# Altium schematic sheet SSFocuser-B-TMC2208-O.SchDoc: YNAO Focuser
size A4; DrawnBy: ShouSheng He; Revision: v1.0
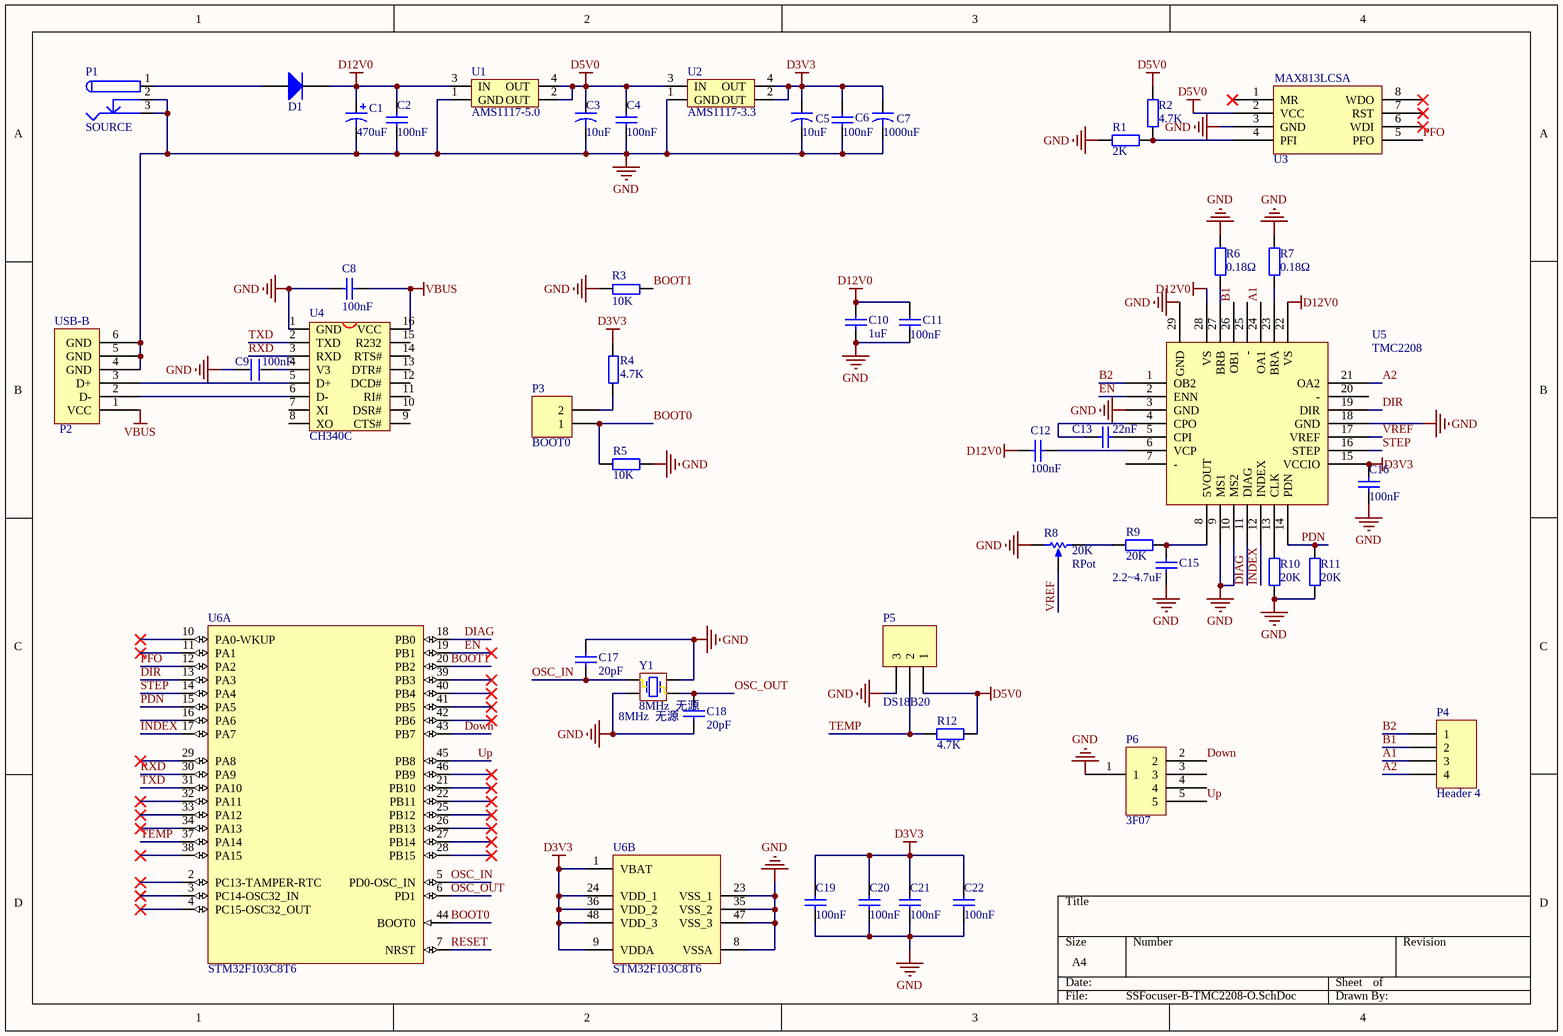
[diagram p0: SSFocuser-B-TMC2208-O.SchDoc]

## Parts
C1  470uF  [16V/470U(CD10X10D5)]
C2  100nF  [0603C]
C3  10uF  [3216]
C4  100nF  [0603C]
C5  10uF  [3216]
C6  100nF  [0603C]
C7  1000uF  [16V/470U(CD10X10D5)]
C8  100nF  [0603C]
C9  100nF  [0603C]
C10  1uF  [1206C]
C11  100nF  [0603C]
C12  100nF  [0603C]
C13  22nF  [0603C]
C15  2.2~4.7uF  [0603C]
C16  100nF  [0603C]
C17  20pF  [0603C]
C18  20pF  [0603C]
C19  100nF  [0603C]
C20  100nF  [0603C]
C21  100nF  [0603C]
C22  100nF  [0603C]
D1  M7  [DO-214AC]  (value not drawn)
P1  SOURCE  [DC005]
P2  USB-B  [USB-B]
P3  BOOT0  [HDR1X2]
P4  Header 4  [XH_4_V]
P5  DS18B20  [TO-92B]
P6  3F07  [3F07]
R1  2K  [0603R]
R2  4.7K  [0603R]
R3  10K  [0603R]
R4  4.7K  [0603R]
R5  10K  [0603R]
R6  0.18Ω  [1206R]
R7  0.18Ω  [1206R]
R8  RPot  value 20K  [VR_SMD]
R9  20K  [0603R]
R10  20K  [0603R]
R11  20K  [0603R]
R12  4.7K  [0603R]
U1  AMS1117-5.0  [SOT223]
U2  AMS1117-3.3  [SOT223]
U3  MAX813LCSA  [SOP-8]
U4  CH340C  [SO-16]
U5  TMC2208  [QFN28]
U6  STM32F103C8T6  [LQFP48_N]  (parts A,B of 2)
Y1  8MHz  无源  [X3225]

## Nets
D3V3: C5.1 C6.2 C7.1 C16.2 C19.2 C20.2 C21.2 C22.2 R4.2 U2.2(OUT) U2.4(OUT) U5.15(VCCIO) U6.1(VBAT) U6.9(VDDA) U6.24(VDD_1) U6.36(VDD_2) U6.48(VDD_3)
D5V0: C3.1 C4.2 P5.1 R2.2 R12.2 U1.2(OUT) U1.4(OUT) U2.3(IN) U3.2(VCC)
D12V0: C1.1 C2.2 C10.1 C11.2 C12.2 D1.2(K) U1.3(IN) U5.22(VS) U5.28(VS)
GND: C1.2 C2.1 C3.2 C4.1 C5.2 C6.1 C7.2 C8.1 C9.1 C10.2 C11.1 C15.1 C16.1 C17.2 C18.2 C19.1 C20.1 C21.1 C22.1 P1.2 P1.3 P2.4(GND) P2.5(GND) P2.6(GND) P5.3 P6.1 R1.2 R3.1 R5.2 R6.1 R7.1 R8.1(TOP) R10.1 R11.1 U1.1(GND) U2.1(GND) U3.3(GND) U4.1(GND) U5.3(GND) U5.9(MS1) U5.10(MS2) U5.18(GND) U5.29(GND) U6.8(VSSA) U6.23(VSS_1) U6.35(VSS_2) U6.47(VSS_3) Y1.2(NA) Y1.4(NA)
VBUS: C8.2 P2.1(VCC) U4.16(VCC)
A1: P4.3 U5.24(OA1)
A2: P4.4 U5.21(OA2)
B1: P4.2 U5.26(OB1)
B2: P4.1 U5.1(OB2)
BOOT0: P3.1 R5.1 U6.44(BOOT0)
BOOT1: R3.2 U6.20(PB2)
DIAG: U5.11(DIAG) U6.18(PB0)
DIR: U5.19(DIR) U6.13(PA3)
Down: P6.2 U6.43(PB7)
EN: U5.2(ENN) U6.19(PB1)
INDEX: U5.12(INDEX) U6.17(PA7)
OSC_IN: C17.1 U6.5(PD0-OSC_IN) Y1.1(OSC1)
OSC_OUT: C18.1 U6.6(PD1) Y1.3(OSC2)
PDN: R11.2 U5.14(PDN) U6.15(PA5)
PFO: U3.5(PFO) U6.12(PA2)
RESET: U6.7(NRST)
RXD: U4.3(RXD) U6.30(PA9)
STEP: U5.16(STEP) U6.14(PA4)
TEMP: P5.2 R12.1 U6.37(PA14)
TXD: U4.2(TXD) U6.31(PA10)
Up: P6.5 U6.45(PB8)
VREF: R8.3(TAP) U5.17(VREF)
NetC9_2: C9.2 U4.4(V3)
NetC12_1: C12.1 U5.6(VCP)
NetC13_1: C13.1 U5.5(CPI)
NetC13_2: C13.2 U5.4(CPO)
NetC15_2: C15.2 R9.1 U5.8(5VOUT)
NetD1_1: D1.1(A) P1.1
NetP2_2: P2.2(D-) U4.6(D-)
NetP2_3: P2.3(D+) U4.5(D+)
NetP3_2: P3.2 R4.1
NetR1_1: R1.1 R2.1 U3.4(PFI)
NetR6_2: R6.2 U5.27(BRB)
NetR7_2: R7.2 U5.23(BRA)
NetR8_2: R8.2(BOT) R9.2
NetR10_2: R10.2 U5.13(CLK)

Not connected (* = marked no-connect by the designer): P6 3 4; U3 1(MR)* 6(WDI)* 7(RST)* 8(WDO)*; U4 7(XI) 8(XO) 9(CTS#) 10(DSR#) 11(RI#) 12(DCD#) 13(DTR#) 14(RTS#) 15(R232); U5 7(-) 20(-) 25(-); U6 2(PC13-TAMPER-RTC)* 3(PC14-OSC32_IN)* 4(PC15-OSC32_OUT)* 10(PA0-WKUP)* 11(PA1)* 16(PA6) 21(PB10)* 22(PB11)* 25(PB12)* 26(PB13)* 27(PB14)* 28(PB15)* 29(PA8)* 32(PA11)* 33(PA12)* 34(PA13)* 38(PA15)* 39(PB3)* 40(PB4)* 41(PB5)* 42(PB6)* 46(PB9)*

## Library data of the parts
C1 = C470UF016S: 470UF      16V      CD10X10D5
C2 C4 C6 C8 C10-C13 C15-C22 = Cap: Capacitor; Published: 8-Jun-2000; LatestRevisionDate: 17-Jul-2002; LatestRevisionNote: Re-released for DXP Platform.; PackageReference: RAD-0.3; Publisher: Altium Limited
  C2 C4 C6 C8 C11 C12 C16 C19-C22: Value: 100nF
  C10: Value: 1uF
  C13: Value: 22nF
  C15: Value: 2.2~4.7uF
  C17 C18: Value: 20pF
C3 C5 C7 = CAP2
  C3 C5: vaule: 10uF
  C7: vaule: 1000uF
C9 = C
D1 = Diode: High Conductance Fast Diode; pin to pad: 1>2 2>1; Published: 8-Jun-2000; LatestRevisionDate: 17-Jul-2002; LatestRevisionNote: Re-released for DXP Platform.; DatasheetDocument: 1997; PackageReference: DO-35; Publisher: Altium Limited; Code_JEDEC: DO-204-AH; ComponentLink1Description: Manufacturer Link; ComponentLink1URL: http://www.fairchildsemi.com/; ComponentLink2Description: Datasheet; ComponentLink2URL: http://www.fairchildsemi.com/ds/1N%2F1N4448.pdf
P3 = MHDR1X2: Header, 2-Pin; LatestRevisionDate: 17-Jul-2002; LatestRevisionNote: Re-released for DXP Platform.; Publisher: Altium Limited
P4 = Header 4: Header, 4-Pin; LatestRevisionDate: 17-Jul-2002; LatestRevisionNote: Re-released for DXP Platform.; Publisher: Altium Limited
P5 = Header 3: Header, 3-Pin; LatestRevisionDate: 17-Jul-2002; LatestRevisionNote: Re-released for DXP Platform.; Publisher: Altium Limited
P6 = 3F07: EarPhone3.5
R1 R2 R5-R7 R9-R12 = RES: Resistor; Value: 1K; Published: 8-Jun-2000; Revision: July-2002: Re-released for DXP Platform.; Publisher: Altium Limited
R3 R4 = R
R8 = RPot: Potentiometer; Sim Note: Enter the Resistance value and the set point into parameter fields.; Set Position: 0.5; Published: 8-Jun-2000; LatestRevisionDate: 17-Jul-2002; LatestRevisionNote: Re-released for DXP Platform.; PackageReference: VR5; Publisher: Altium Limited; PackageDescription: Variable Resistor, Thru-Hole; 3 Leads
U1 U2 = AMS1117
U3 = MAX813L
U4 = CH340G: USB2UART
U6 = STM32F103C8T6: STM32 ARM-based 32-bit MCU Performance Line with 64 kB Flash, 20 kB Internal RAM, -40 to +85癈 Temperature, 48-Pin LQFP, Tray; DatasheetVersion: rev13.0, Apr-2011; PackageVersion: rev13, Apr-2011; PackageReference: LQFP48; PackageDescription: 48-Pin Low-Profile Quad Flat Pack, 7 x 7 mm Body, 0.5 mm Pitch (LQFP48); ComponentLink1Description: Manufacturer URL; ComponentLink1URL: http://www.st.com/; ComponentLink2Description: STM32F103 Datasheet; ComponentLink2URL: http://www.st.com/internet/com/TECHNICAL_RESOURCES/TECHNICAL_LITERATURE/DATASHEET/CD00161566.pdf; ComponentLink3Description: STM32 Family Web Page; ComponentLink3URL: www.st.com/stm32
Y1 = XTAL_1: Crystal Oscillator; Published: 8-Jun-2000; LatestRevisionDate: 17-Jul-2002; LatestRevisionNote: Re-released for DXP Platform.; PackageReference: R38; Publisher: Altium Limited; Value: 8MHz  无源
P1 = SOURCE: LatestRevisionDate: 17-Jul-2002; LatestRevisionNote: Re-released for DXP Platform.; Publisher: Altium Limited